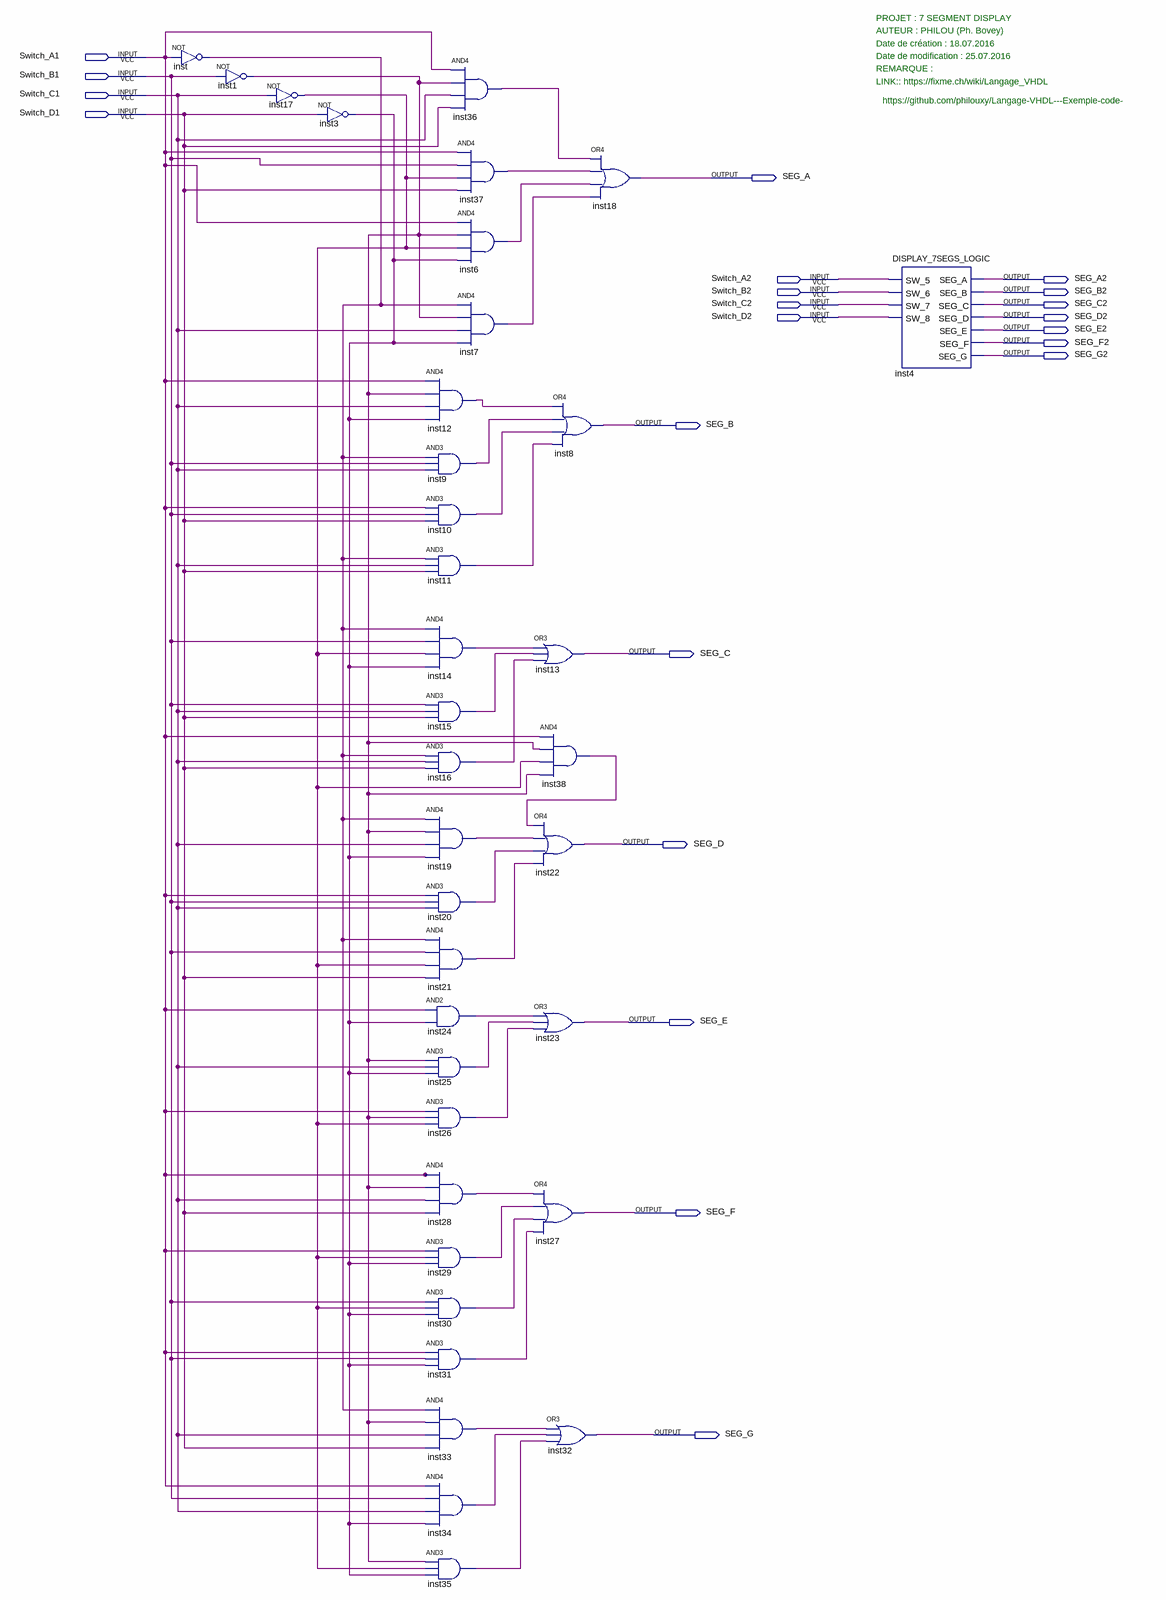
[diagram p0: schematic sheet]
// Quartus schematic 7segs_schematics.bdf as structural Verilog: 37 symbols, 22 pins
module \7segs_schematics  (
  input  Switch_A1,
  input  Switch_B1,
  input  Switch_C1,
  input  Switch_D1,
  input  Switch_A2,
  input  Switch_B2,
  input  Switch_C2,
  input  Switch_D2,
  output SEG_A,
  output SEG_A2,
  output SEG_B2,
  output SEG_C2,
  output SEG_D2,
  output SEG_E2,
  output SEG_F2,
  output SEG_G2,
  output SEG_B,
  output SEG_C,
  output SEG_D,
  output SEG_E,
  output SEG_F,
  output SEG_G
);

  wire inst1_out, inst3_out, inst6_out, inst7_out, inst9_out, inst10_out, inst11_out, inst12_out, inst14_out,
       inst15_out, inst16_out, inst17_out, inst19_out, inst20_out, inst21_out, inst24_out, inst25_out,
       inst26_out, inst28_out, inst29_out, inst30_out, inst31_out, inst33_out, inst34_out, inst35_out,
       inst36_out, inst37_out, inst38_out, inst_out;

  not inst (inst_out, Switch_A1);
  not inst1 (inst1_out, Switch_B1);
  not inst17 (inst17_out, Switch_C1);
  not inst3 (inst3_out, Switch_D1);
  and inst12 (inst12_out, Switch_A1, inst1_out, Switch_C1, inst3_out);
  and inst9 (inst9_out, inst_out, Switch_B1, Switch_C1);
  and inst10 (inst10_out, Switch_A1, Switch_B1, Switch_D1);
  and inst11 (inst11_out, inst_out, Switch_C1, Switch_D1);
  and inst14 (inst14_out, inst_out, Switch_B1, inst17_out, inst3_out);
  and inst15 (inst15_out, Switch_B1, Switch_C1, Switch_D1);
  and inst16 (inst16_out, inst_out, Switch_C1, Switch_D1);
  and inst19 (inst19_out, inst_out, inst1_out, Switch_C1, inst3_out);
  and inst20 (inst20_out, Switch_A1, Switch_B1, Switch_C1);
  and inst21 (inst21_out, inst_out, Switch_B1, inst17_out, Switch_D1);
  and inst24 (inst24_out, Switch_A1, inst3_out);
  and inst25 (inst25_out, inst1_out, Switch_C1, inst3_out);
  and inst26 (inst26_out, Switch_A1, inst1_out, inst17_out);
  and inst28 (inst28_out, Switch_A1, inst1_out, Switch_C1, Switch_D1);
  and inst29 (inst29_out, Switch_A1, inst17_out, inst3_out);
  and inst30 (inst30_out, Switch_B1, inst17_out, inst3_out);
  and inst31 (inst31_out, Switch_A1, Switch_B1, inst3_out);
  and inst33 (inst33_out, inst_out, inst1_out, Switch_C1, Switch_D1);
  and inst34 (inst34_out, Switch_A1, Switch_B1, Switch_C1, inst3_out);
  and inst35 (inst35_out, inst1_out, inst17_out, inst3_out);
  and inst36 (inst36_out, Switch_A1, inst1_out, Switch_C1, Switch_D1);
  and inst37 (inst37_out, Switch_A1, Switch_B1, inst17_out, Switch_D1);
  and inst6 (inst6_out, Switch_A1, inst1_out, inst17_out, inst3_out);
  and inst7 (inst7_out, inst_out, inst1_out, Switch_C1, inst3_out);
  or inst13 (SEG_C, inst14_out, inst15_out, inst16_out);
  and inst38 (inst38_out, Switch_A1, inst1_out, inst17_out, inst1_out);
  or inst22 (SEG_D, inst38_out, inst19_out, inst20_out, inst21_out);
  or inst23 (SEG_E, inst24_out, inst25_out, inst26_out);
  or inst27 (SEG_F, inst28_out, inst29_out, inst30_out, inst31_out);
  or inst18 (SEG_A, inst36_out, inst37_out, inst6_out, inst7_out);
  or inst8 (SEG_B, inst12_out, inst9_out, inst10_out, inst11_out);
  or inst32 (SEG_G, inst33_out, inst34_out, inst35_out);
  DISPLAY_7SEGS_LOGIC inst4 (
    .SW_5(Switch_A2), .SW_6(Switch_B2), .SW_7(Switch_C2), .SW_8(Switch_D2), .SEG_A(SEG_A2), .SEG_B(SEG_B2),
    .SEG_C(SEG_C2), .SEG_D(SEG_D2), .SEG_E(SEG_E2), .SEG_F(SEG_F2), .SEG_G(SEG_G2));

  // Notes on the sheet:
  //   PROJET : 7 SEGMENT DISPLAY
  //   AUTEUR : PHILOU (Ph. Bovey)
  //   Date de création : 18.07.2016
  //   Date de modification : 25.07.2016
  //   REMARQUE :
  //   LINK:: https://fixme.ch/wiki/Langage_VHDL
  //   https://github.com/philouxy/Langage-VHDL---Exemple-code-
endmodule
